# EAGLE schematic ac-dc.brd_2014-10-19 (EAGLE 6.6.0)
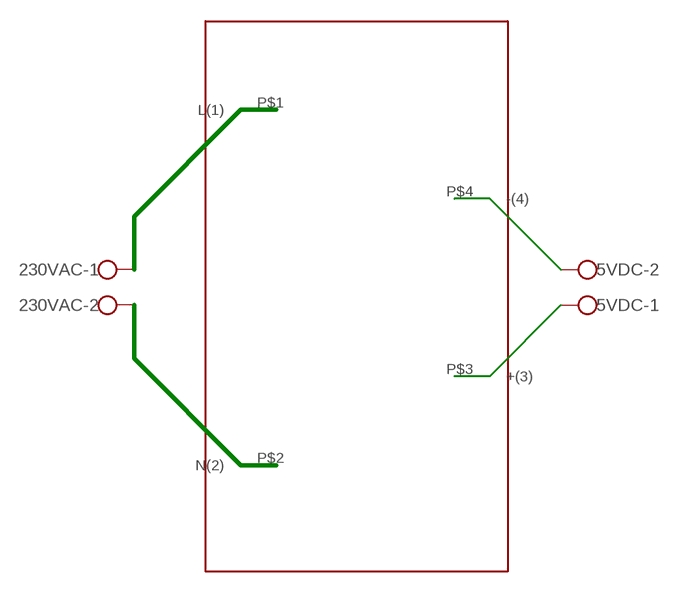
[diagram p0: schematic, sheet 1]

## Parts
5VDC  W237-102  [W237-102]
230VAC  W237-102  [W237-102]
U$2  VTX_214  [VTX-214-005]

## Nets
N$1: 5VDC.2 U$2.P$4(-(4))
N$2: 5VDC.1 U$2.P$3(+(3))
N$3: 230VAC.2 U$2.P$2(N(2))
N$4: 230VAC.1 U$2.P$1(L(1))

## Library data of the parts
5VDC 230VAC = con-wago-500:W237-102: WAGO SCREW CLAMP; MPN: 237-102; OC_FARNELL: unknown; OC_NEWARK: 70K9898
U$2 = VTX-214:VTX_214